# Altium schematic sheet EXT_SLOT.SchDoc
size A4
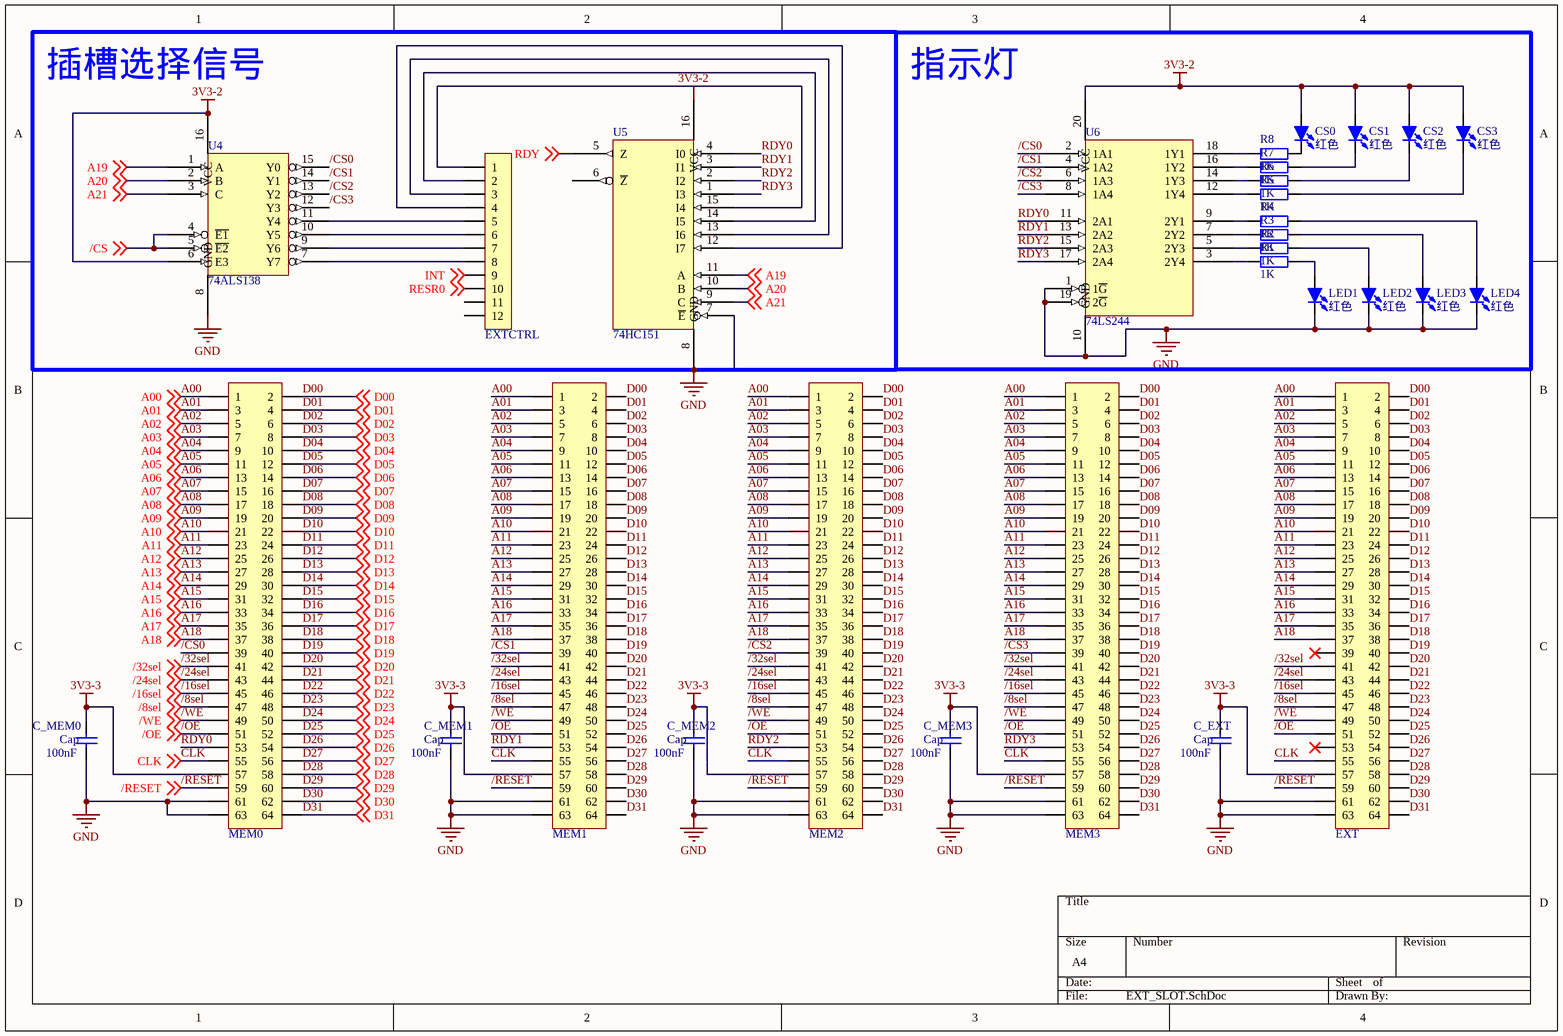
[diagram p0: EXT_SLOT.SchDoc]

## Parts
C_EXT  Cap  value 100nF  [0805]
C_MEM0  Cap  value 100nF  [0805]
C_MEM1  Cap  value 100nF  [0805]
C_MEM2  Cap  value 100nF  [0805]
C_MEM3  Cap  value 100nF  [0805]
CS0  红色  [LED 5MM-B]
CS1  红色  [LED 5MM-B]
CS2  红色  [LED 5MM-B]
CS3  红色  [LED 5MM-B]
EXT  Header 2X32  [IDC2.54-V64D]  (value not drawn)
EXTCTRL  HDR-1X12  [SIP12]  (value not drawn)
LED1  红色  [LED 5MM-B]
LED2  红色  [LED 5MM-B]
LED3  红色  [LED 5MM-B]
LED4  红色  [LED 5MM-B]
MEM0  Header 2X32  [IDC2.54-V64D]  (value not drawn)
MEM1  Header 2X32  [IDC2.54-V64D]  (value not drawn)
MEM2  Header 2X32  [IDC2.54-V64D]  (value not drawn)
MEM3  Header 2X32  [IDC2.54-V64D]  (value not drawn)
R1  1K  [0805]
R2  1K  [0805]
R3  1K  [0805]
R4  1K  [0805]
R5  1K  [0805]
R6  1K  [0805]
R7  1K  [0805]
R8  1K  [0805]
U4  74ALS138  [SO-16]
U5  74HC151  [SO-16]
U6  74LS244  [SOJ-20]

## Blocks framed on the sheet
插槽选择信号: EXTCTRL U4 U5

## Nets
3V3-2: CS0.1(A) CS1.1(A) CS2.1(A) CS3.1(A) U4.6(E3) U4.16(VCC) U5.16(VCC) U6.20(VCC)  [also labelled VCC]
3V3-3: C_EXT.2 C_MEM0.2 C_MEM1.2 C_MEM2.2 C_MEM3.2 EXT.57 MEM0.57 MEM1.57 MEM2.57 MEM3.57
GND: C_EXT.1 C_MEM0.1 C_MEM1.1 C_MEM2.1 C_MEM3.1 EXT.61 EXT.63 LED1.2(K) LED2.2(K) LED3.2(K) LED4.2(K) MEM0.61 MEM0.63 MEM1.61 MEM1.63 MEM2.61 MEM2.63 MEM3.61 MEM3.63 U4.8(GND) U5.7(~{E}) U5.8(GND) U6.1(1~{G}) U6.10(GND) U6.19(2~{G})
/8sel: EXT.47 MEM0.47 MEM1.47 MEM2.47 MEM3.47 ; off-sheet /8sel
/16sel: EXT.45 MEM0.45 MEM1.45 MEM2.45 MEM3.45 ; off-sheet /16sel
/24sel: EXT.43 MEM0.43 MEM1.43 MEM2.43 MEM3.43 ; off-sheet /24sel
/32sel: EXT.41 MEM0.41 MEM1.41 MEM2.41 MEM3.41 ; off-sheet /32sel
/CS: U4.4(~{E1}) U4.5(~{E2}) ; off-sheet /CS
/CS0: MEM0.39 U4.15(Y0) U6.2(1A1)
/CS1: MEM1.39 U4.14(Y1) U6.4(1A2)
/CS2: MEM2.39 U4.13(Y2) U6.6(1A3)
/CS3: MEM3.39 U4.12(Y3) U6.8(1A4)
/OE: EXT.51 MEM0.51 MEM1.51 MEM2.51 MEM3.51 ; off-sheet /OE
/RESET: EXT.59 MEM0.59 MEM1.59 MEM2.59 MEM3.59 ; off-sheet /RESET
/WE: EXT.49 MEM0.49 MEM1.49 MEM2.49 MEM3.49 ; off-sheet /WE
A00: EXT.1 MEM0.1 MEM1.1 MEM2.1 MEM3.1 ; off-sheet A00
A01: EXT.3 MEM0.3 MEM1.3 MEM2.3 MEM3.3 ; off-sheet A01
A02: EXT.5 MEM0.5 MEM1.5 MEM2.5 MEM3.5 ; off-sheet A02
A03: EXT.7 MEM0.7 MEM1.7 MEM2.7 MEM3.7 ; off-sheet A03
A04: EXT.9 MEM0.9 MEM1.9 MEM2.9 MEM3.9 ; off-sheet A04
A05: EXT.11 MEM0.11 MEM1.11 MEM2.11 MEM3.11 ; off-sheet A05
A06: EXT.13 MEM0.13 MEM1.13 MEM2.13 MEM3.13 ; off-sheet A06
A07: EXT.15 MEM0.15 MEM1.15 MEM2.15 MEM3.15 ; off-sheet A07
A08: EXT.17 MEM0.17 MEM1.17 MEM2.17 MEM3.17 ; off-sheet A08
A09: EXT.19 MEM0.19 MEM1.19 MEM2.19 MEM3.19 ; off-sheet A09
A10: EXT.21 MEM0.21 MEM1.21 MEM2.21 MEM3.21 ; off-sheet A10
A11: EXT.23 MEM0.23 MEM1.23 MEM2.23 MEM3.23 ; off-sheet A11
A12: EXT.25 MEM0.25 MEM1.25 MEM2.25 MEM3.25 ; off-sheet A12
A13: EXT.27 MEM0.27 MEM1.27 MEM2.27 MEM3.27 ; off-sheet A13
A14: EXT.29 MEM0.29 MEM1.29 MEM2.29 MEM3.29 ; off-sheet A14
A15: EXT.31 MEM0.31 MEM1.31 MEM2.31 MEM3.31 ; off-sheet A15
A16: EXT.33 MEM0.33 MEM1.33 MEM2.33 MEM3.33 ; off-sheet A16
A17: EXT.35 MEM0.35 MEM1.35 MEM2.35 MEM3.35 ; off-sheet A17
A18: EXT.37 MEM0.37 MEM1.37 MEM2.37 MEM3.37 ; off-sheet A18
A19: U4.1(A) U5.11(A) ; off-sheet A19
A20: U4.2(B) U5.10(B) ; off-sheet A20
A21: U4.3(C) U5.9(C) ; off-sheet A21
CLK: EXT.55 MEM0.55 MEM1.55 MEM2.55 MEM3.55 ; off-sheet CLK
D00: EXT.2 MEM0.2 MEM1.2 MEM2.2 MEM3.2 ; off-sheet D00
D01: EXT.4 MEM0.4 MEM1.4 MEM2.4 MEM3.4 ; off-sheet D01
D02: EXT.6 MEM0.6 MEM1.6 MEM2.6 MEM3.6 ; off-sheet D02
D03: EXT.8 MEM0.8 MEM1.8 MEM2.8 MEM3.8 ; off-sheet D03
D04: EXT.10 MEM0.10 MEM1.10 MEM2.10 MEM3.10 ; off-sheet D04
D05: EXT.12 MEM0.12 MEM1.12 MEM2.12 MEM3.12 ; off-sheet D05
D06: EXT.14 MEM0.14 MEM1.14 MEM2.14 MEM3.14 ; off-sheet D06
D07: EXT.16 MEM0.16 MEM1.16 MEM2.16 MEM3.16 ; off-sheet D07
D08: EXT.18 MEM0.18 MEM1.18 MEM2.18 MEM3.18 ; off-sheet D08
D09: EXT.20 MEM0.20 MEM1.20 MEM2.20 MEM3.20 ; off-sheet D09
D10: EXT.22 MEM0.22 MEM1.22 MEM2.22 MEM3.22 ; off-sheet D10
D11: EXT.24 MEM0.24 MEM1.24 MEM2.24 MEM3.24 ; off-sheet D11
D12: EXT.26 MEM0.26 MEM1.26 MEM2.26 MEM3.26 ; off-sheet D12
D13: EXT.28 MEM0.28 MEM1.28 MEM2.28 MEM3.28 ; off-sheet D13
D14: EXT.30 MEM0.30 MEM1.30 MEM2.30 MEM3.30 ; off-sheet D14
D15: EXT.32 MEM0.32 MEM1.32 MEM2.32 MEM3.32 ; off-sheet D15
D16: EXT.34 MEM0.34 MEM1.34 MEM2.34 MEM3.34 ; off-sheet D16
D17: EXT.36 MEM0.36 MEM1.36 MEM2.36 MEM3.36 ; off-sheet D17
D18: EXT.38 MEM0.38 MEM1.38 MEM2.38 MEM3.38 ; off-sheet D18
D19: EXT.40 MEM0.40 MEM1.40 MEM2.40 MEM3.40 ; off-sheet D19
D20: EXT.42 MEM0.42 MEM1.42 MEM2.42 MEM3.42 ; off-sheet D20
D21: EXT.44 MEM0.44 MEM1.44 MEM2.44 MEM3.44 ; off-sheet D21
D22: EXT.46 MEM0.46 MEM1.46 MEM2.46 MEM3.46 ; off-sheet D22
D23: EXT.48 MEM0.48 MEM1.48 MEM2.48 MEM3.48 ; off-sheet D23
D24: EXT.50 MEM0.50 MEM1.50 MEM2.50 MEM3.50 ; off-sheet D24
D25: EXT.52 MEM0.52 MEM1.52 MEM2.52 MEM3.52 ; off-sheet D25
D26: EXT.54 MEM0.54 MEM1.54 MEM2.54 MEM3.54 ; off-sheet D26
D27: EXT.56 MEM0.56 MEM1.56 MEM2.56 MEM3.56 ; off-sheet D27
D28: EXT.58 MEM0.58 MEM1.58 MEM2.58 MEM3.58 ; off-sheet D28
D29: EXT.60 MEM0.60 MEM1.60 MEM2.60 MEM3.60 ; off-sheet D29
D30: EXT.62 MEM0.62 MEM1.62 MEM2.62 MEM3.62 ; off-sheet D30
D31: EXT.64 MEM0.64 MEM1.64 MEM2.64 MEM3.64 ; off-sheet D31
INT: EXTCTRL.9 ; off-sheet INT
RDY: U5.5(Z) ; off-sheet RDY
RDY0: MEM0.53 U5.4(I0) U6.11(2A1)
RDY1: MEM1.53 U5.3(I1) U6.13(2A2)
RDY2: MEM2.53 U5.2(I2) U6.15(2A3)
RDY3: MEM3.53 U5.1(I3) U6.17(2A4)
RESR0: EXTCTRL.10 ; off-sheet RESR0
NetCS0_2: CS0.2(K) R8.2
NetCS1_2: CS1.2(K) R7.2
NetCS2_2: CS2.2(K) R6.2
NetCS3_2: CS3.2(K) R5.2
NetEXTCTRL_1: EXTCTRL.1 U5.15(I4)
NetEXTCTRL_2: EXTCTRL.2 U5.14(I5)
NetEXTCTRL_3: EXTCTRL.3 U5.13(I6)
NetEXTCTRL_4: EXTCTRL.4 U5.12(I7)
NetEXTCTRL_5: EXTCTRL.5 U4.11(Y4)
NetEXTCTRL_6: EXTCTRL.6 U4.10(Y5)
NetEXTCTRL_7: EXTCTRL.7 U4.9(Y6)
NetEXTCTRL_8: EXTCTRL.8 U4.7(Y7)
NetLED1_1: LED1.1(A) R1.2
NetLED2_1: LED2.1(A) R2.2
NetLED3_1: LED3.1(A) R3.2
NetLED4_1: LED4.1(A) R4.2
NetR1_1: R1.1 U6.3(2Y4)
NetR2_1: R2.1 U6.5(2Y3)
NetR3_1: R3.1 U6.7(2Y2)
NetR4_1: R4.1 U6.9(2Y1)
NetR5_1: R5.1 U6.12(1Y4)
NetR6_1: R6.1 U6.14(1Y3)
NetR7_1: R7.1 U6.16(1Y2)
NetR8_1: R8.1 U6.18(1Y1)

Not connected (* = marked no-connect by the designer): EXT 39* 53*; EXTCTRL 11 12; U5 6(~{Z})

## Notes on the sheet
- 指示灯

## Library data of the parts
C_EXT C_MEM0-C_MEM3 = Cap: Capacitor; Published: 8-Jun-2000; LatestRevisionDate: 17-Jul-2002; LatestRevisionNote: Re-released for DXP Platform.; PackageReference: RAD-0.3; Publisher: Altium Limited; PackageDescription: Radial Cap, Thru-Hole; 2 Leads; 0.3 in Pin Spacing
CS0-CS3 LED1-LED4 = LED-5MM: 5mm插件LED; 版权归属: 源创客; BOM名称: 5mm插件LED; 学习资源: www.ooocke.com
EXT MEM0-MEM3 = Header 32X2: 32*2P接插件; BOM名称: 20*2P接插件; 版权归属: 源创客; 学习资源: www.ooocke.com
EXTCTRL = Header 12: 12P接插件; 版权归属: 源创客; BOM名称: 12P接插件; 学习资源: www.ooocke.com
R1-R8 = R: 贴片电阻; 版权归属: 源创客; BOM名称: 贴片电阻; 学习资源: www.ooocke.com